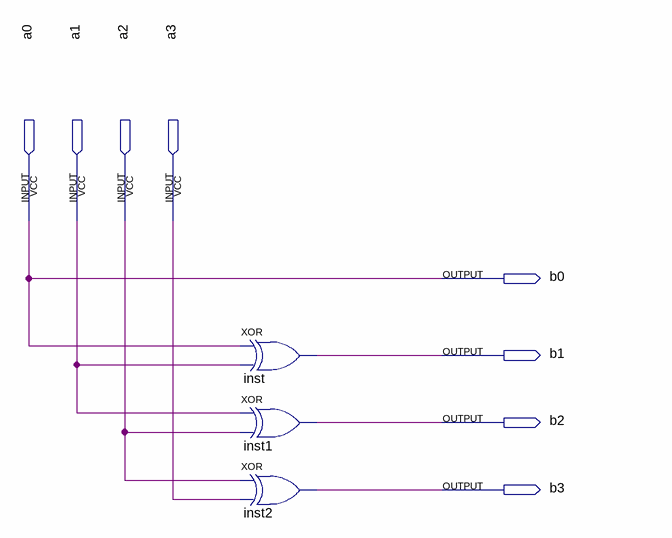
[diagram p0: schematic sheet]
// Quartus schematic LAB04_1.bdf as structural Verilog: 3 symbols, 8 pins
module LAB04_1 (
  input  a0,
  input  a1,
  input  a2,
  input  a3,
  output b0,
  output b1,
  output b2,
  output b3
);

  xor inst (b1, a0, a1);
  xor inst1 (b2, a1, a2);
  xor inst2 (b3, a2, a3);

  assign b0 = a0;
endmodule
